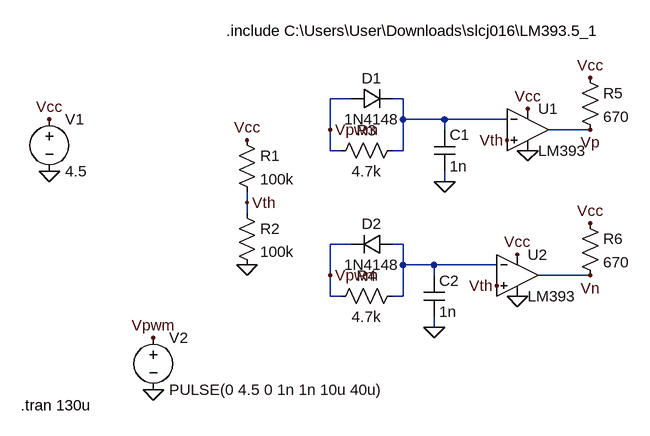
[diagram p0: schematic BBM.asc]
BBM.asc, the LTspice schematic file:
Version 4
SHEET 1 880 680
WIRE 112 112 80 112
WIRE 192 112 176 112
WIRE 192 144 192 112
WIRE 256 144 192 144
WIRE 352 144 256 144
WIRE 80 160 80 112
WIRE 256 160 256 144
WIRE 480 160 416 160
WIRE 80 192 80 160
WIRE 96 192 80 192
WIRE 192 192 192 144
WIRE 192 192 176 192
WIRE 256 240 256 224
WIRE -48 272 -48 256
WIRE -48 288 -48 272
WIRE 112 336 80 336
WIRE 192 336 176 336
WIRE 192 368 192 336
WIRE 240 368 192 368
WIRE 336 368 240 368
WIRE 80 384 80 336
WIRE 240 384 240 368
WIRE 480 384 400 384
WIRE 80 416 80 384
WIRE 96 416 80 416
WIRE 192 416 192 368
WIRE 192 416 176 416
WIRE 240 464 240 448
FLAG -352 224 0
FLAG -352 144 Vcc
FLAG 384 128 Vcc
FLAG 368 352 Vcc
FLAG -48 176 Vcc
FLAG -48 368 0
FLAG -48 272 Vth
FLAG 352 176 Vth
FLAG 336 400 Vth
FLAG 256 240 0
FLAG 240 464 0
FLAG 368 416 0
FLAG 384 192 0
FLAG 480 304 Vcc
FLAG 80 160 Vpwm
FLAG 80 384 Vpwm
FLAG -192 480 Vpwm
FLAG -192 560 0
FLAG 480 384 Vn
FLAG 480 80 Vcc
FLAG 480 160 Vp
SYMBOL OpAmps\\opamp2 384 96 R0
SYMATTR InstName U1
SYMATTR Value LM393
SYMBOL OpAmps\\opamp2 368 320 R0
SYMATTR InstName U2
SYMATTR Value LM393
SYMBOL voltage -352 128 R0
WINDOW 123 0 0 Left 0
WINDOW 39 0 0 Left 0
SYMATTR InstName V1
SYMATTR Value 4.5
SYMBOL res -64 160 R0
SYMATTR InstName R1
SYMATTR Value 100k
SYMBOL res -64 272 R0
SYMATTR InstName R2
SYMATTR Value 100k
SYMBOL cap 240 160 R0
SYMATTR InstName C1
SYMATTR Value 1n
SYMBOL cap 224 384 R0
SYMATTR InstName C2
SYMATTR Value 1n
SYMBOL diode 112 128 R270
WINDOW 0 32 32 VTop 2
WINDOW 3 0 32 VBottom 2
SYMATTR InstName D1
SYMATTR Value 1N4148
SYMBOL diode 176 320 R90
WINDOW 0 0 32 VBottom 2
WINDOW 3 32 32 VTop 2
SYMATTR InstName D2
SYMATTR Value 1N4148
SYMBOL res 192 176 R90
WINDOW 0 0 56 VBottom 2
WINDOW 3 32 56 VTop 2
SYMATTR InstName R3
SYMATTR Value 4.7k
SYMBOL res 192 400 R90
WINDOW 0 0 56 VBottom 2
WINDOW 3 32 56 VTop 2
SYMATTR InstName R4
SYMATTR Value 4.7k
SYMBOL voltage -192 464 R0
WINDOW 123 0 0 Left 0
WINDOW 39 0 0 Left 0
SYMATTR InstName V2
SYMATTR Value PULSE(0 4.5 0 1n 1n 10u 40u)
SYMBOL res 464 288 R0
SYMATTR InstName R6
SYMATTR Value 670
SYMBOL res 464 64 R0
SYMATTR InstName R5
SYMATTR Value 670
TEXT -80 8 Left 2 !.include C:\\Users\\User\\Downloads\\slcj016\\LM393.5_1
TEXT -396 584 Left 2 !.tran 130u

The netlist it stands for:
* BBM.asc
XU1 Vth N001 Vcc 0 Vp LM393  ; pins In+ In- V+ V- OUT
XU2 Vth N002 Vcc 0 Vn LM393  ; pins In+ In- V+ V- OUT
V1 Vcc 0 4.5
R1 Vcc Vth 100k
R2 Vth 0 100k
C1 N001 0 1n
C2 N002 0 1n
D1 Vpwm N001 1N4148
D2 N002 Vpwm 1N4148
R3 N001 Vpwm 4.7k
R4 N002 Vpwm 4.7k
V2 Vpwm 0 PULSE(0 4.5 0 1n 1n 10u 40u)
R6 Vcc Vn 670
R5 Vcc Vp 670
.model D D
.lib standard.dio
.include C:\Users\User\Downloads\slcj016\LM393.5_1
.tran 130u
.backanno
.end